# Altium schematic sheet main.SchDoc
size A2
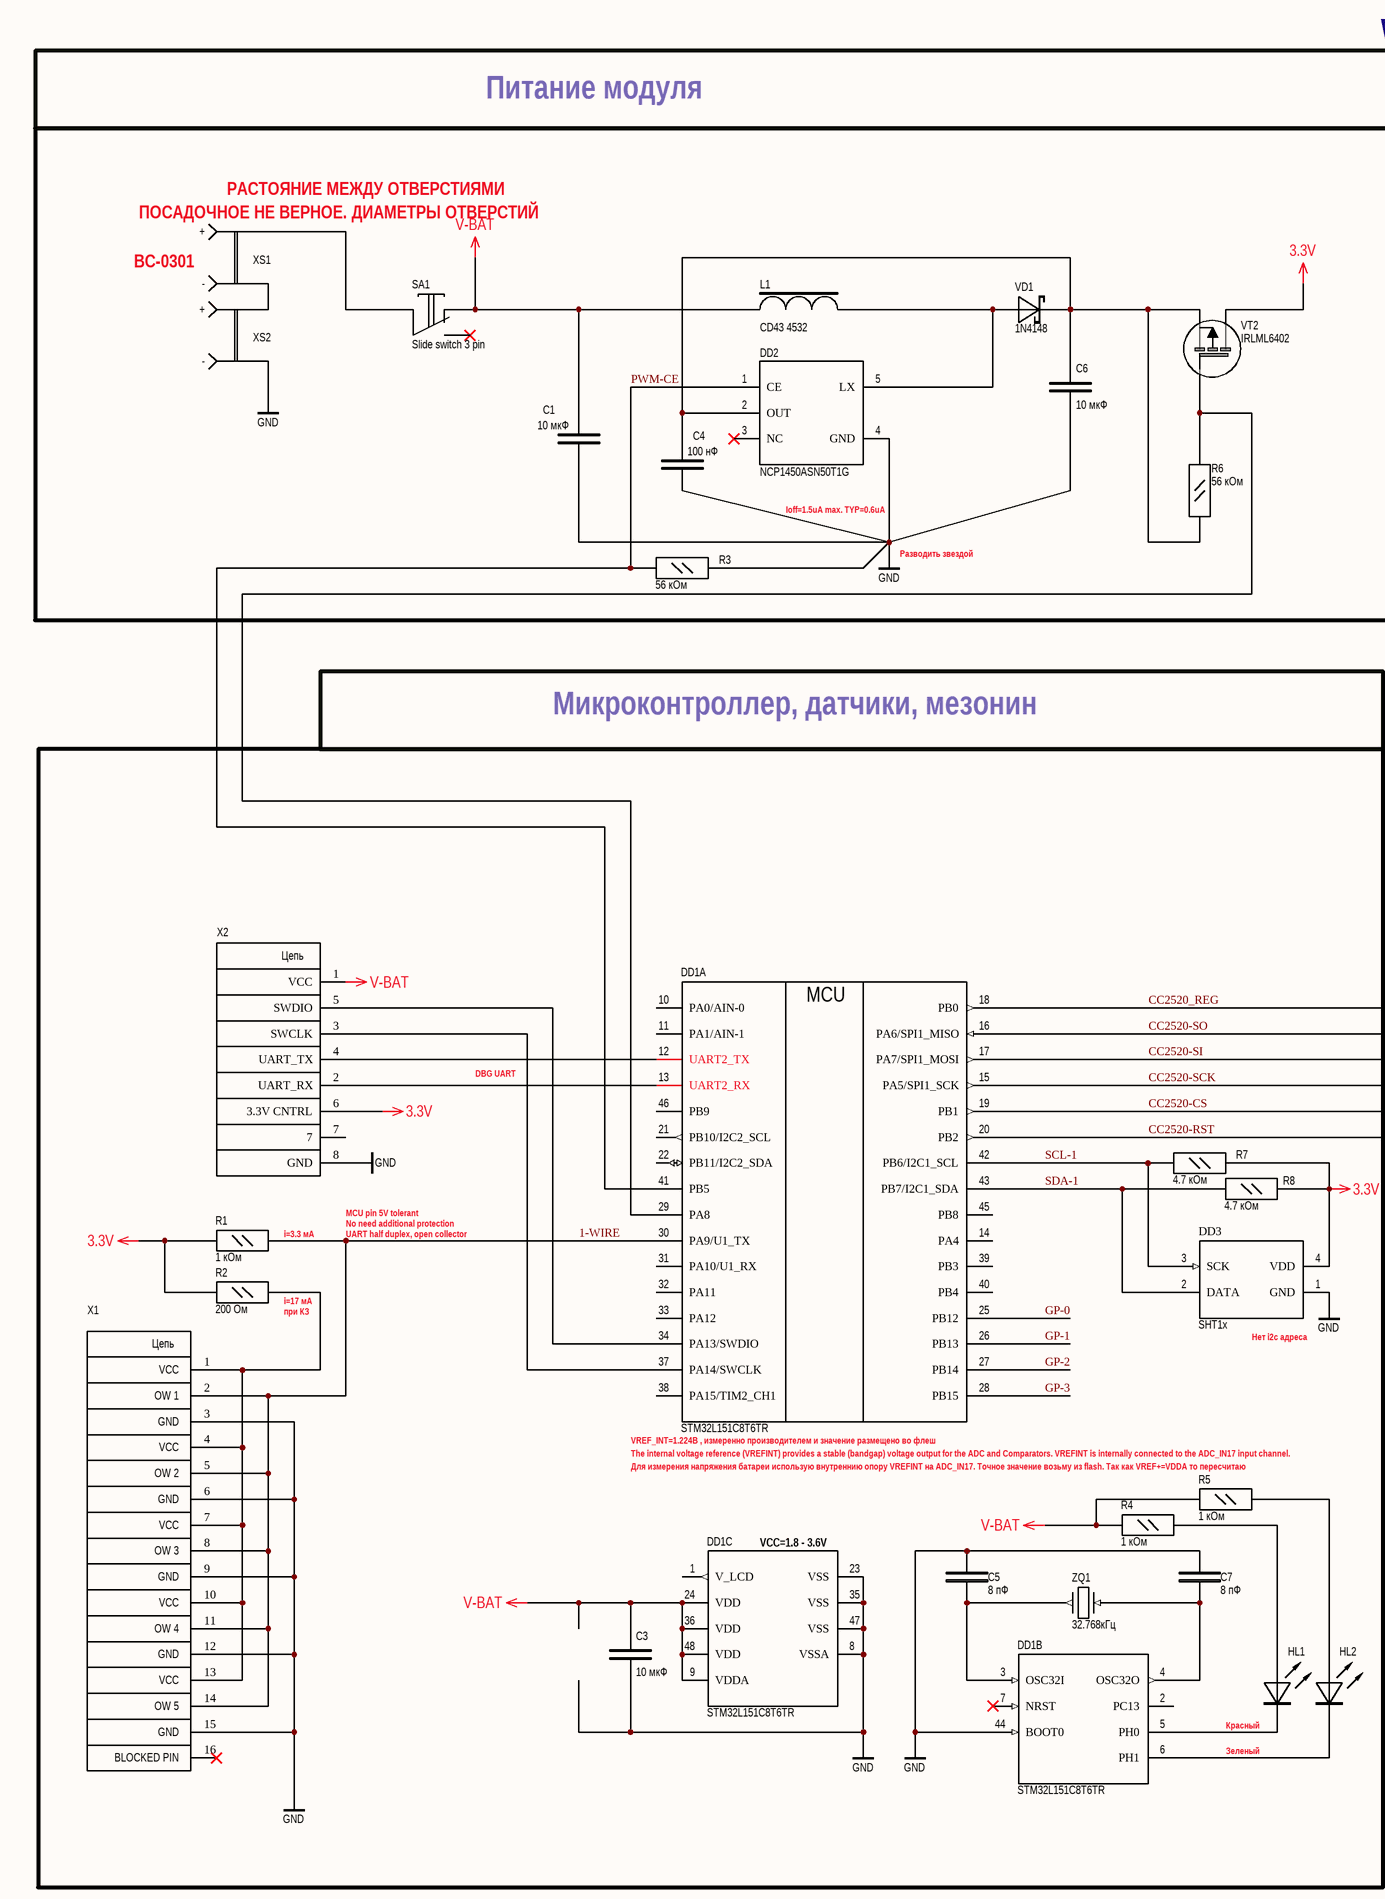
[diagram p0: main.SchDoc, left]
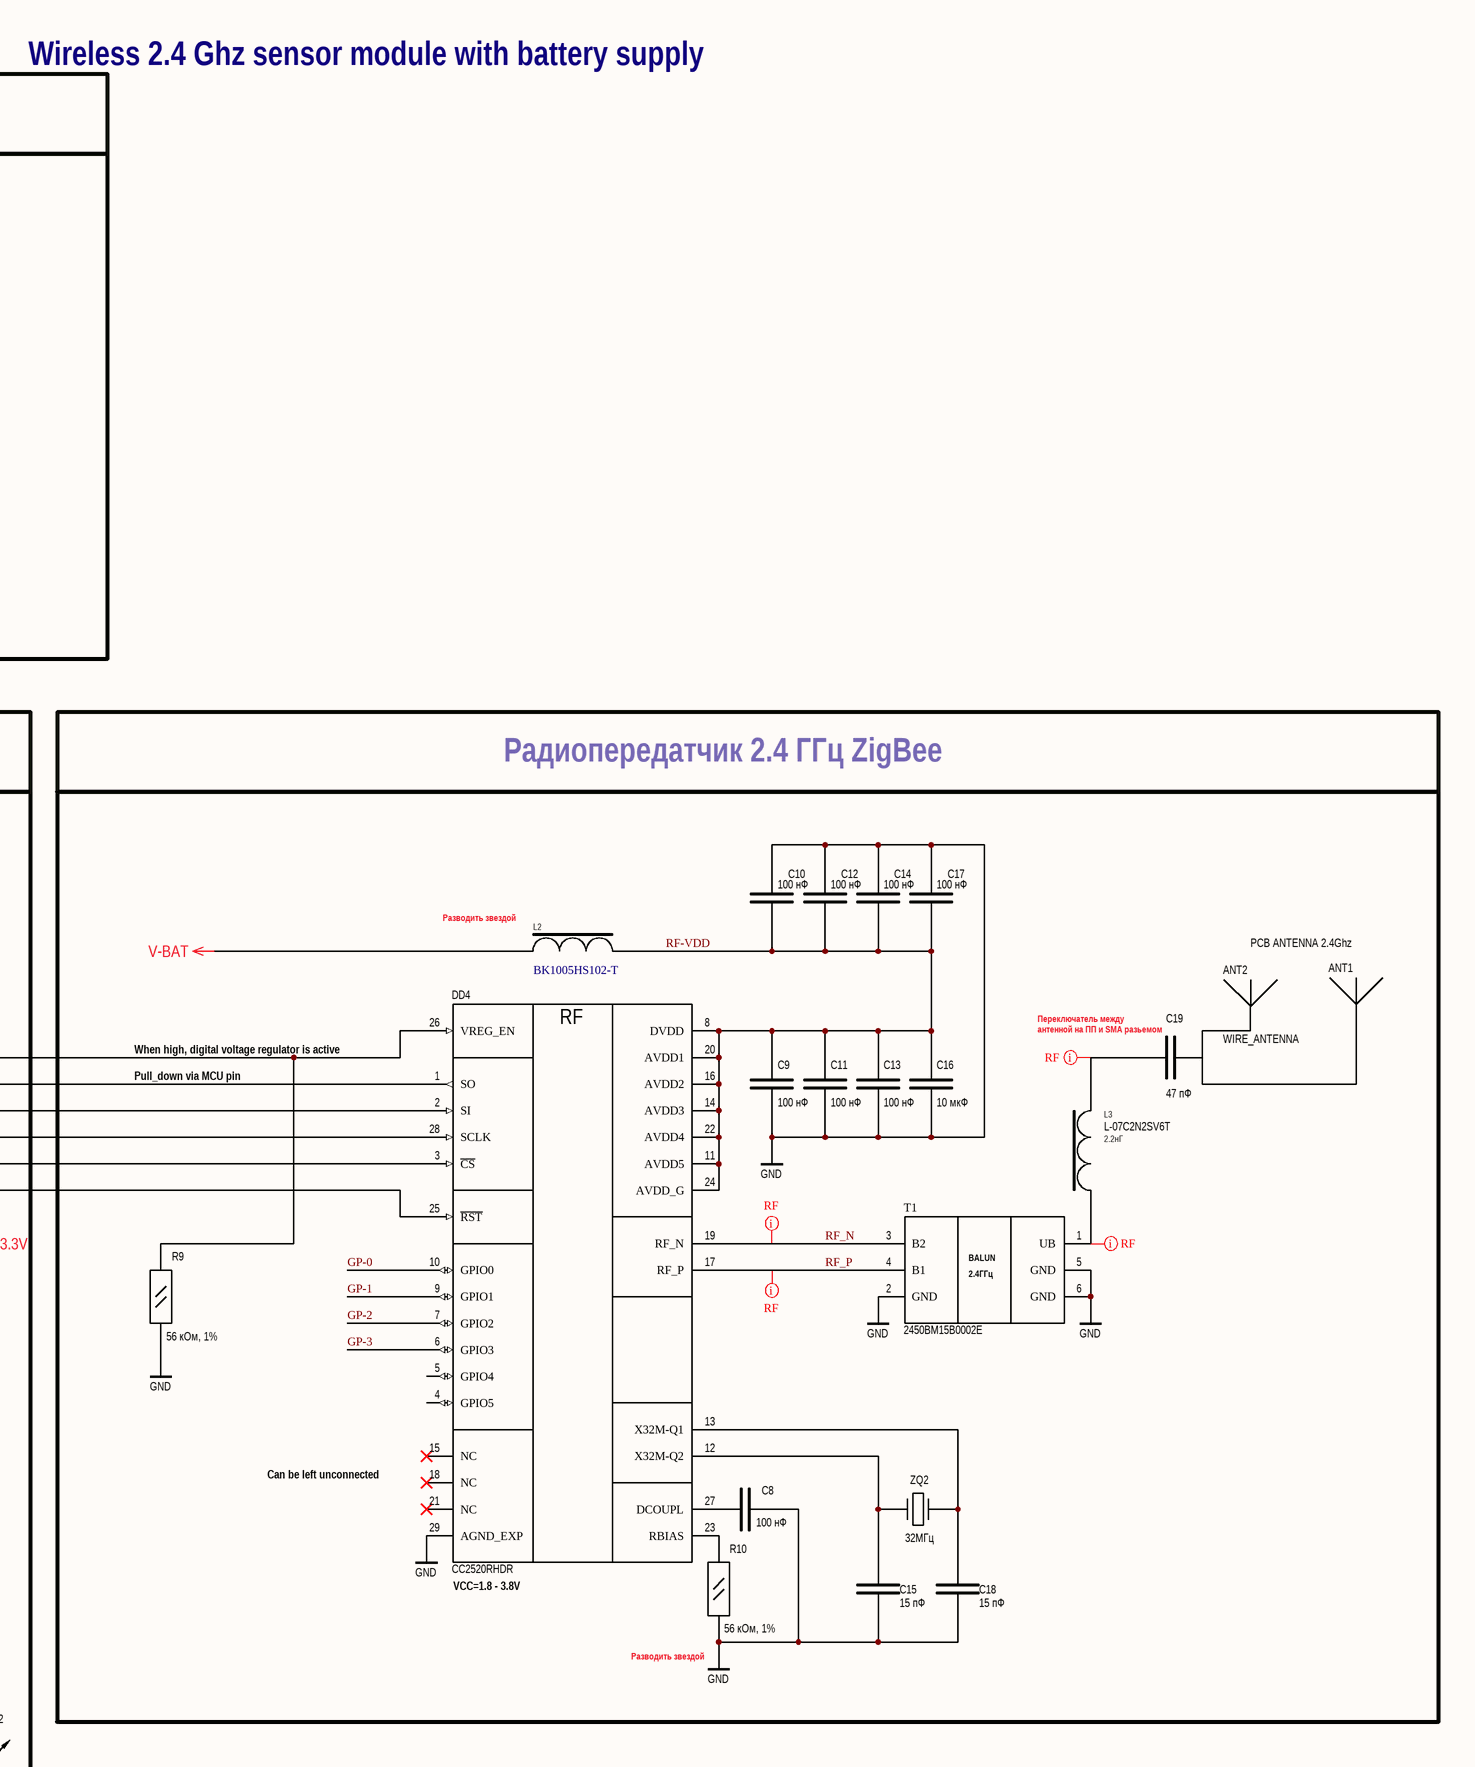
[diagram p1: main.SchDoc, right]

## Parts
ANT1  PCB ANTENNA 2.4Ghz  [F-antena]
ANT2  WIRE_ANTENNA  [WIRED ANTENA 2.4GHz]
C1  10 мкФ  [CAP0805]
C3  10 мкФ  [CAP0805]
C4  100 нФ  [CAP0402]
C5  8 пФ  [CAP0402]
C6  10 мкФ  [CAP0805]
C7  8 пФ  [CAP0402]
C8  value 100 нФ  [CAP0402]
C9  100 нФ  [CAP0402]
C10  100 нФ  [CAP0402]
C11  100 нФ  [CAP0402]
C12  100 нФ  [CAP0402]
C13  100 нФ  [CAP0402]
C14  100 нФ  [CAP0402]
C15  15 пФ  [CAP0402]
C16  10 мкФ  [CAP0805]
C17  100 нФ  [CAP0402]
C18  15 пФ  [CAP0402]
C19  47 пФ  [CAP0402 -  SWITCH]
DD1  STM32L151C8T6TR  [LQFP-48]  (parts A,B,C of 3)
DD2  NCP1450ASN50T1G  [SOT-23-5]
DD3  SHT1x  [SHT1x]
DD4  CC2520RHDR  [QFN28]
HL1  LED  [KP-2012EC]  (value not drawn)
HL2  LED  [KP-2012SGC]  (value not drawn)
L1  CD43 4532  [CD43]
L2  BK1005HS102-T  [IND0402]
L3  L-07C2N2SV6T  value 2.2нГ  [CAP0402]
R1  value 1 кОм  [RES0402]  (hidden comment: RES0805)
R2  value 200 Ом  [RES0402]  (hidden comment: RES0805)
R3  value 56 кОм  [RES0402]  (hidden comment: RES0805)
R4  value 1 кОм  [RES0402]  (hidden comment: RES0805)
R5  value 1 кОм  [RES0402]  (hidden comment: RES0805)
R6  value 56 кОм  [RES0402]  (hidden comment: RES0805)
R7  value 4.7 кОм  [RES0402]  (hidden comment: RES0805)
R8  value 4.7 кОм  [RES0402]  (hidden comment: RES0805)
R9  value 56 кОм, 1%  [RES0402]  (hidden comment: RES0805)
R10  value 56 кОм, 1%  [RES0402]  (hidden comment: RES0805)
SA1  Slide switch 3 pin  [L-KLS7-SS-12F19-G5]
T1  2450BM15B0002E  [2450BM15B0002]
VD1  1N4148  [SOD-123]
VT2  IRLML6402  [SOT-23-3]
X1  ?  [IDC-16MR]  (value not drawn)
X2  ?  [PBD-08 - POGO PIN]  (value not drawn)
XS1  Топология ПП  [KEYSTONE AA CLIPS]  (value not drawn)
XS2  Топология ПП  [KEYSTONE AA CLIPS]  (value not drawn)
ZQ1  32.768кГц  [Crystal_1]
ZQ2  32МГц  [HC49/S]

## Blocks framed on the sheet
VCC=1.8 - 3.6V: C3 C5 C7 DD1 DD3 HL1 HL2 R1 R2 R4 R5 R7 R8 X1 X2 ZQ1

## Nets
3.3V: DD3.4(VDD) R1.2 R2.2 R7.1 R8.1 VT2.D(Drain) X2.6(3.3V_CNTRL)
GND: C1.1 C3.1 C4.1 C5.2 C6.1 C7.2 C8.2 C9.1 C10.1 C11.1 C12.1 C13.1 C14.1 C15.1 C16.1 C17.1 C18.1 DD1.8(VSSA) DD1.23(VSS) DD1.35(VSS) DD1.44(BOOT0) DD1.47(VSS) DD2.4(GND) DD3.1(GND) DD4.29(AGND_EXP) R3.1 R9.1 R10.1 T1.2(GND) T1.5(GND) T1.6(GND) X1.3(GND) X1.6(GND) X1.9(GND) X1.12(GND) X1.15(GND) X2.8(GND) XS2.2(-)
V-BAT: C1.2 C3.2 DD1.9(VDDA) DD1.24(VDD) DD1.36(VDD) DD1.48(VDD) L1.1 L2.1 R4.2 R5.2 SA1.1 X2.1(VCC)
1-WIRE: DD1.30(PA9/U1_TX) R1.1 X1.2(OW_1) X1.5(OW_2) X1.8(OW_3) X1.11(OW_4) X1.14(OW_5)
CC2520-CS: DD1.19(PB1) DD4.3(~{CS})
CC2520-RST: DD1.20(PB2) DD4.25(~{RST})
CC2520-SCK: DD1.15(PA5/SPI1_SCK) DD4.28(SCLK)
CC2520-SI: DD1.17(PA7/SPI1_MOSI) DD4.2(SI)
CC2520-SO: DD1.16(PA6/SPI1_MISO) DD4.1(SO)
CC2520_REG: DD1.18(PB0) DD4.26(VREG_EN) R9.2
GP-0: DD1.25(PB12) DD4.10(GPIO0)
GP-1: DD1.26(PB13) DD4.9(GPIO1)
GP-2: DD1.27(PB14) DD4.7(GPIO2)
GP-3: DD1.28(PB15) DD4.6(GPIO3)
PWM-CE: DD1.41(PB5) DD2.1(CE) R3.2
RF-VDD: C9.2 C10.2 C11.2 C12.2 C13.2 C14.2 C16.2 C17.2 DD4.8(DVDD) DD4.11(AVDD5) DD4.14(AVDD3) DD4.16(AVDD2) DD4.20(AVDD1) DD4.22(AVDD4) DD4.24(AVDD_G) L2.2
RF_N: DD4.19(RF_N) T1.3(B2)
RF_P: DD4.17(RF_P) T1.4(B1)
SCL-1: DD1.42(PB6/I2C1_SCL) DD3.3(SCK) R7.2
SDA-1: DD1.43(PB7/I2C1_SDA) DD3.2(DATA) R8.2
NetANT1_0: ANT1.0 C19.3
NetANT2_1: ANT2.1 C19.2
NetC4_2: C4.2 C6.2 DD2.2(OUT) R6.2 VD1.C(Cathode) VT2.S(Source)
NetC5_1: C5.1 DD1.3(OSC32I) ZQ1.1
NetC7_1: C7.1 DD1.4(OSC32O) ZQ1.2
NetC8_1: C8.1 DD4.27(DCOUPL)
NetC15_2: C15.2 DD4.12(X32M-Q2) ZQ2.2
NetC18_2: C18.2 DD4.13(X32M-Q1) ZQ2.1
NetC19_1: C19.1 L3.2
NetDD1_5: DD1.5(PH0) HL1.C(Cathode)
NetDD1_6: DD1.6(PH1) HL2.C(Cathode)
NetDD1_12: DD1.12(UART2_TX) X2.4(UART_TX)
NetDD1_13: DD1.13(UART2_RX) X2.2(UART_RX)
NetDD1_29: DD1.29(PA8) R6.1 VT2.G(Gate)
NetDD1_34: DD1.34(PA13/SWDIO) X2.5(SWDIO)
NetDD1_37: DD1.37(PA14/SWCLK) X2.3(SWCLK)
NetDD2_5: DD2.5(LX) L1.2 VD1.A(Anode)
NetDD4_23: DD4.23(RBIAS) R10.2
NetHL1_A: HL1.A(Anode) R4.1
NetHL2_A: HL2.A(Anode) R5.1
NetL3_1: L3.1 T1.1(UB)
NetR2_1: R2.1 X1.1(VCC) X1.4(VCC) X1.7(VCC) X1.10(VCC) X1.13(VCC)
NetSA1_2: SA1.2 XS1.1(+)
NetXS1_2: XS1.2(-) XS2.1(+)

Not connected (* = marked no-connect by the designer): DD1 1(V_LCD) 2(PC13) 7(NRST)* 10(PA0/AIN-0) 11(PA1/AIN-1) 14(PA4) 21(PB10/I2C2_SCL) 22(PB11/I2C2_SDA) 31(PA10/U1_RX) 32(PA11) 33(PA12) 38(PA15/TIM2_CH1) 39(PB3) 40(PB4) 45(PB8) 46(PB9); DD2 3(NC)*; DD4 4(GPIO5) 5(GPIO4) 15(NC)* 18(NC)* 21(NC)*; SA1 3*; X1 16(BLOCKED_PIN)*; X2 7

## Layout directives
net class Undefined: NetC19_1, NetL3_1, RF_N, RF_P

## Notes on the sheet
- Wireless 2.4 Ghz sensor module with battery supply
- Питание модуля
- (near XS1) РАСТОЯНИЕ МЕЖДУ ОТВЕРСТИЯМИ
- (near XS1) BC-0301
- (near XS1) ПОСАДОЧНОЕ НЕ ВЕРНОЕ. ДИАМЕТРЫ ОТВЕРСТИЙ
- Ioff=1.5uA max. TYP=0.6uA
- Разводить звездой
- Микроконтроллер, датчики, мезонин
- Радиопередатчик 2.4 ГГц ZigBee
- (near L2) Разводить звездой
- (near C19) Переключатель между
- (near C19) антенной на ПП и SMA разьемом
- Pull_down via MCU pin
- (near DD4) When high, digital voltage regulator is active
- DBG UART
- (near R1) i=3.3 мА
- UART half duplex, open collector
- MCU pin 5V tolerant
- No need additional protection
- (near R2) i=17 мА
- (near R2) при КЗ
- (near DD3) Нет i2c адреса
- (near DD1) VREF_INT=1.224В , измеренно производителем и значение размещено во флеш
- (near DD4) Can be left unconnected
- The internal voltage reference (VREFINT) provides a stable (bandgap) voltage output for the ADC and Comparators. VREFINT is internally connected to the ADC_IN17 input channel.
- (near R5) Для измерения напряжения батареи использую внутреннию опору VREFINT на ADC_IN17. Точное значение возьму из flash. Так как VREF+=VDDA то пересчитаю
- (near DD4) VCC=1.8 - 3.8V
- (near R10) Разводить звездой
- (near HL1) Зеленый
- (near HL1) Красный
- (in symbol 2450BM15B0002E) BALUN; 2.4ГГц
- (in symbol CC2520RHDR) RF
- (in symbol IDC-16-MR) Цепь
- (in symbol STM32L151C8T6TR, part A) MCU
- (in symbol Разьем_8_под_pogopin) Цепь

## Library data of the parts
C1 C6 = CAP0805: value: 10 мкФ
  C1: price: 0.1
  C6: price: 1
C3-C5 C7-C18 = CAP0805: Конденсатор
  C3: value: 10 мкФ; price: 1
  C4 C9-C14 C17: value: 100 нФ; price: 0.1
  C5 C7: value: 8 пФ; price: 0.1
  C8: price: 0.1
  C15 C18: value: 15 пФ; price: 0.1
  C16: value: 10 мкФ; price: 0.1
C19 = CAP0402 SMD SWITCH: value: 47 пФ
DD1 = STM32L151C8T6TR: Микроконтроллер; Value: *; price: 107
DD2 = NCP1400ASN33T1G: Step Up PWM; value: *
DD3 = SHT1x: Датчик влажности/температуры; price: 770
HL1 = LED: Светодиод красный; Type: ?; value: ?; price: 1.5
HL2 = LED: Светодиод зеленый; Type: ?; value: ?; price: 1.5
L1 = CD43 4532: Дросель; value: ?; price: 2
L2 = BK1005HS102-T: Дросель; value: ?
L3 = L-07C2N2SV6T: Дросель высокочастотный; price: 1.5
R1-R10 = RES0805: Резистор 0805; price: 0.1
SA1 = L-KLS7-SS-12F19-G5: Type: ?
VD1 = 1N4148: Диод Шотки; Type: ?; value: ?; price: 0.8
VT2 = IRLML6402: p-mosfet   -20V 3.7A; pin to pad: D>c G>b S>e; Type: ?; value: IRLML6402
X1 = IDC-16-MR: Type: ?; value: ?
X2 = Разьем_8_под_pogopin: Type: ?; value: ?
XS1 XS2 = Battery AA Clips on PCB: Напаеваемые держатели для батарей АА на ПП
ZQ1 = 32.768 кГц: Кварцевый резонатор; Type: ?; value: 32.768кГц; price: 6
ZQ2 = HC-49S 32МГц: Кварцевый резонатор; Type: ?; value: 32МГц; price: 6
DD4 = CC2520RHDR: type: *; value: *; price: 110
T1 = 2450BM15B0002E: type: *; value: *; price: 20